# Altium schematic sheet 300_Control.SchDoc: Control
size A3; SheetNumber: 5; SheetTotal: 7
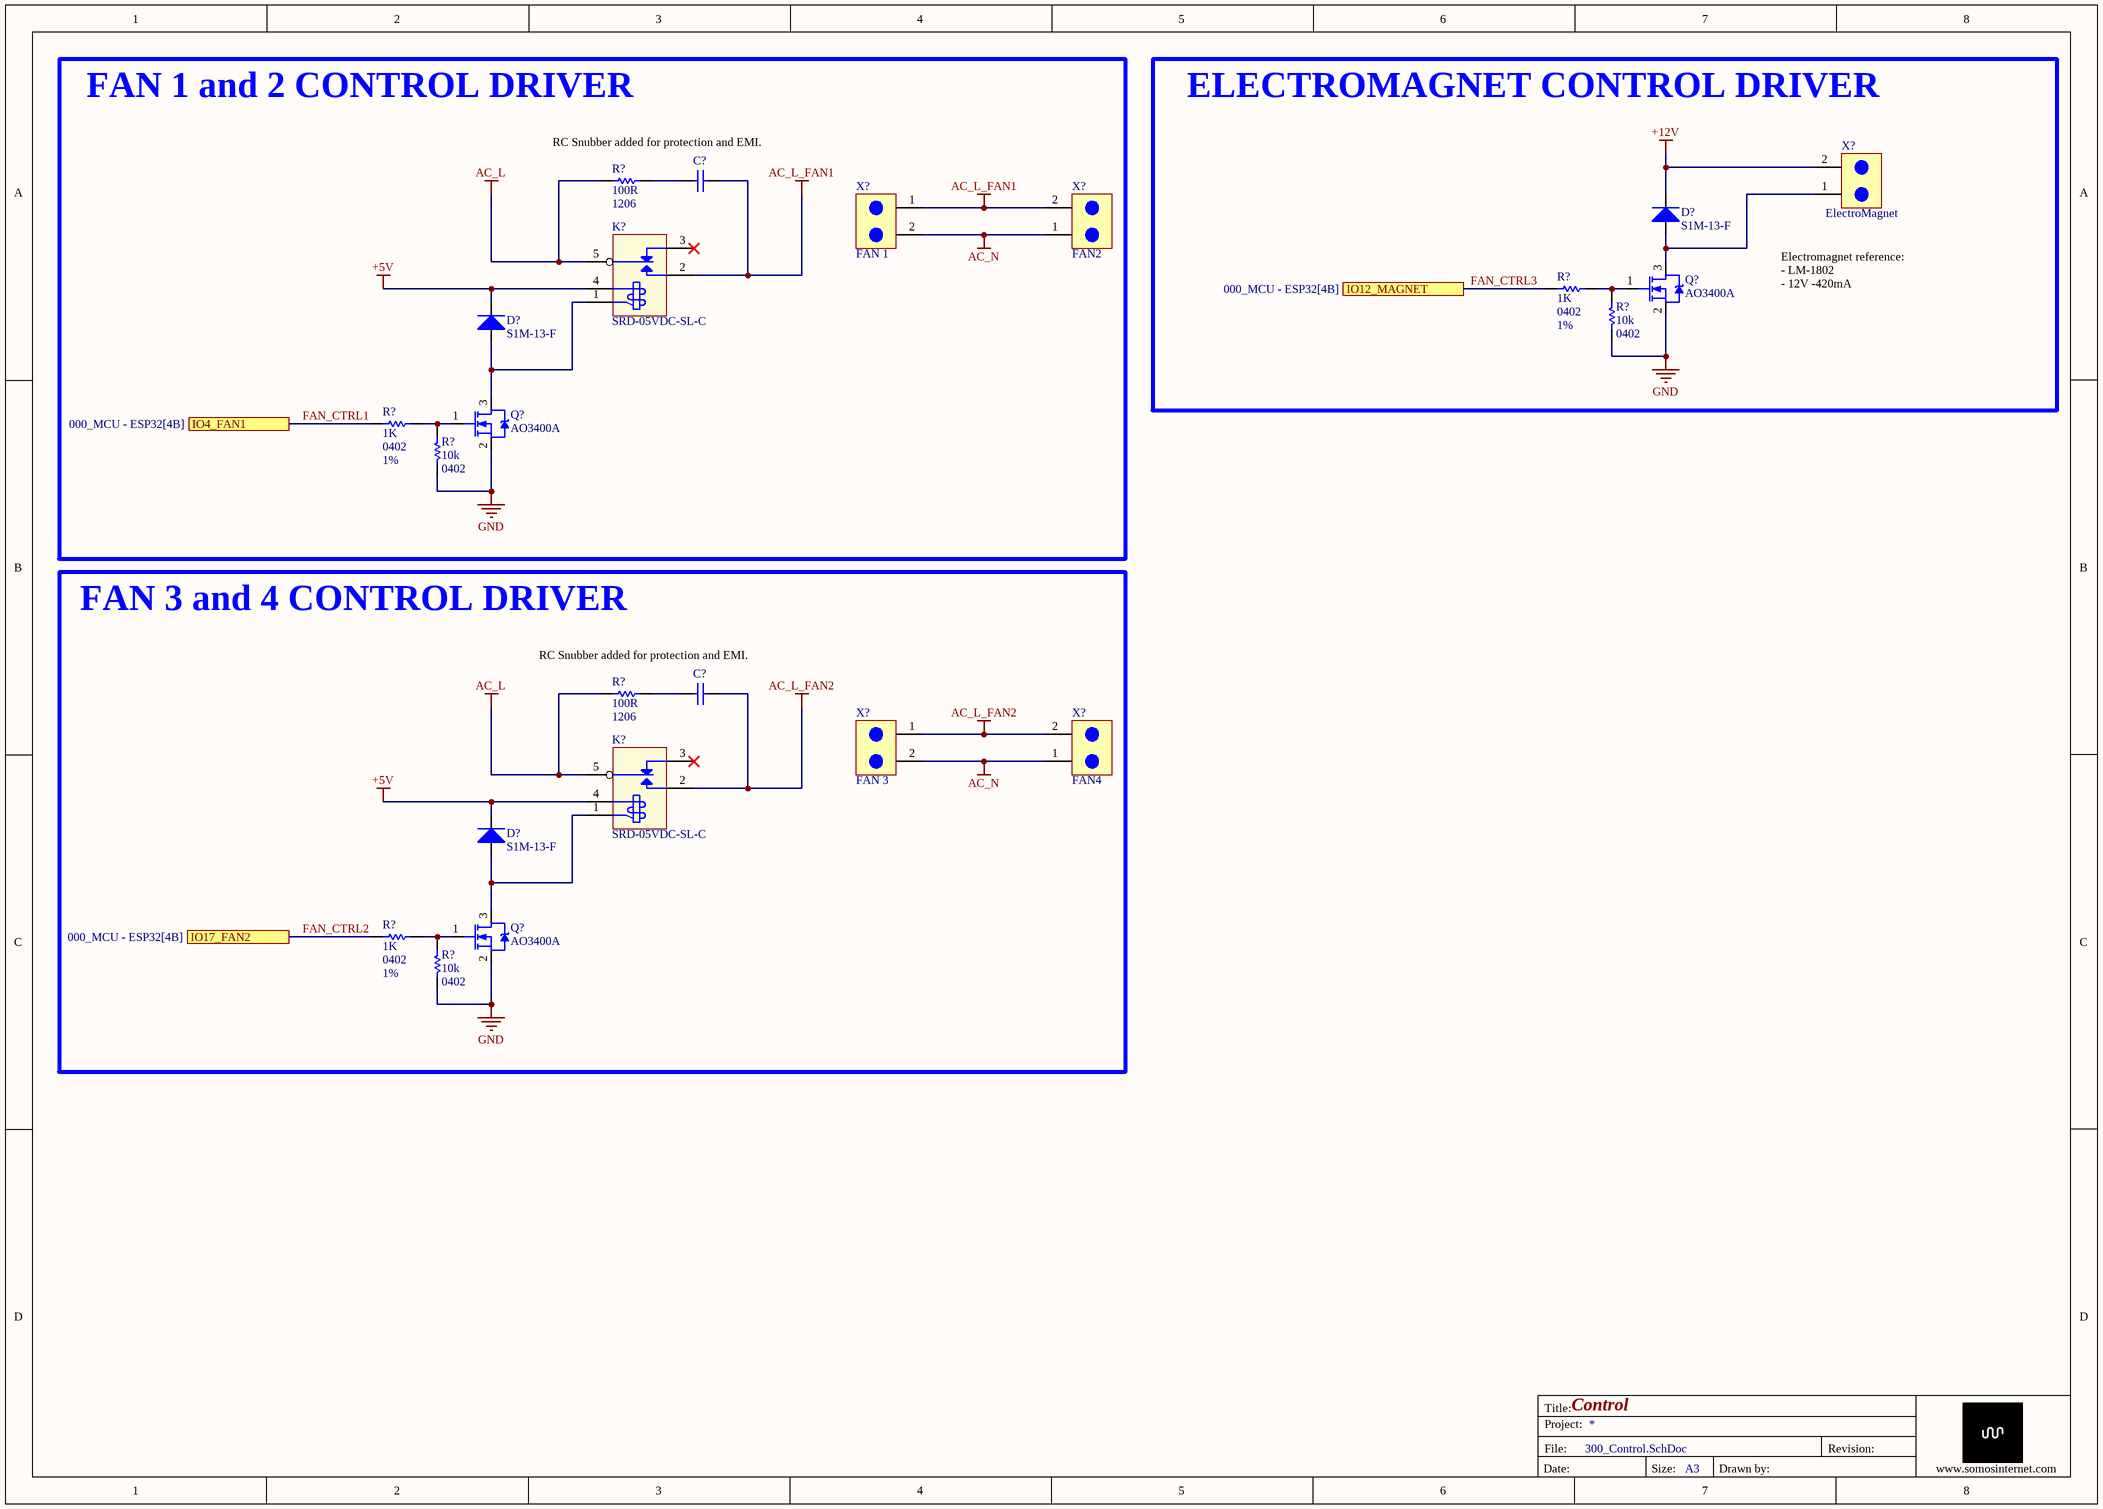
[diagram p0: 300_Control.SchDoc]

## Parts
(Parts that share a designator on the sheet are numbered #1, #2 ... from top to bottom, then left to right.)
C?#1  MPX104K31C3KN15600  [Safety Capacitor TH,P=10mm]  (value not drawn)
C?#2  MPX104K31C3KN15600  [Safety Capacitor TH,P=10mm]  (value not drawn)
D?#1  S1M-13-F  [DO214AC]
D?#2  S1M-13-F  [DO214AC]
D?#3  S1M-13-F  [DO214AC]
K?#1  SRD-05VDC-SL-C  [Relay_1C TH_19.2x15.6mm]
K?#2  SRD-05VDC-SL-C  [Relay_1C TH_19.2x15.6mm]
Q?#1  AO3400A  [SOT23_N]
Q?#2  AO3400A  [SOT23_N]
Q?#3  AO3400A  [SOT23_N]
R?#1  100R  PackageReference: 1206  [RESC3216X06N[1206]]
R?#2  1K  PackageReference: 0402  Tolerance: 1%  [RESC1005X03N[0402]]
R?#3  10k  PackageReference: 0402  [RESC1005X03N[0402]]
R?#4  1K  PackageReference: 0402  Tolerance: 1%  [RESC1005X03N[0402]]
R?#5  10k  PackageReference: 0402  [RESC1005X03N[0402]]
R?#6  100R  PackageReference: 1206  [RESC3216X06N[1206]]
R?#7  1K  PackageReference: 0402  Tolerance: 1%  [RESC1005X03N[0402]]
R?#8  10k  PackageReference: 0402  [RESC1005X03N[0402]]
X?#1  FAN 1  [TH,Right Angle,P=5mm]
X?#2  ElectroMagnet  [TH,Right Angle,P=5mm]
X?#3  FAN2  [TH,Right Angle,P=5mm]
X?#4  FAN 3  [TH,Right Angle,P=5mm]
X?#5  FAN4  [TH,Right Angle,P=5mm]

## Blocks framed on the sheet
FAN 1 and 2 CONTROL DRIVER: C?#1 D?#2 K?#1 Q?#2 R?#1 R?#4 R?#5 X?#1 X?#3
ELECTROMAGNET CONTROL DRIVER: D?#1 Q?#1 R?#2 R?#3 X?#2
FAN 3 and 4 CONTROL DRIVER: C?#2 D?#3 K?#2 Q?#3 R?#6-R?#8 X?#4 X?#5

## Ports
IO4_FAN1 (see 000_MCU - ESP32[4B]), IO12_MAGNET (see 000_MCU - ESP32[4B]), IO17_FAN2 (see 000_MCU - ESP32[4B])

## Nets
+5V: D?#2.K D?#3.K K?#1.4 K?#2.4
+12V: D?#1.K X?#2.2
AC_L: K?#1.5 K?#2.5 R?#1.1 R?#6.1
AC_L_FAN1: C?#1.2 K?#1.2 X?#1.1 X?#3.2
AC_L_FAN2: C?#2.2 K?#2.2 X?#4.1 X?#5.2
AC_N: X?#1.2 X?#3.1 X?#4.2 X?#5.1
GND: Q?#1.2(S) Q?#2.2(S) Q?#3.2(S) R?#3.2 R?#5.2 R?#8.2
FAN_CTRL1: R?#4.2 ; port IO4_FAN1
FAN_CTRL2: R?#7.2 ; port IO17_FAN2
FAN_CTRL3: R?#2.2 ; port IO12_MAGNET
NetC?#1_1: C?#1.1 R?#1.2
NetC?#2_1: C?#2.1 R?#6.2
NetD?#1_A: D?#1.A Q?#1.3(D) X?#2.1
NetD?#2_A: D?#2.A K?#1.1 Q?#2.3(D)
NetD?#3_A: D?#3.A K?#2.1 Q?#3.3(D)
NetQ?#1_1: Q?#1.1(G) R?#2.1 R?#3.1
NetQ?#2_1: Q?#2.1(G) R?#4.1 R?#5.1
NetQ?#3_1: Q?#3.1(G) R?#7.1 R?#8.1

Not connected (* = marked no-connect by the designer): K?#1 3*; K?#2 3*

## Notes on the sheet
- RC Snubber added for protection and EMI.
- Electromagnet reference:
  - LM-1802
  - 12V -420mA
- Title:
- Project:
- File:
- Revision:
- Date:
- Size:
- A3
- Drawn by:
- www.somosinternet.com <http://www.somosinternet.com>

## Library data of the parts
C?#1 C?#2 = Safety Capacitor MPX104K31C3KN15600: CAP SAFETY 100nF ±10% 275V 305V 310V TH; Manufacturer: KNSCHA; Manufacturer Part Number: MPX104K31C3KN15600; Supplier 1: LCSC; Supplier Part Number 1: C489079; ComponentLink1Description: LCSC; ComponentLink1URL: https://www.lcsc.com/product-detail/C489079.html
D?#1-D?#3 = Diode: DIODES S1M-13-F; Supplier Part Number 1: C155378; Supplier 1: LCSC; Manufacturer: DIODES; Manufacturer PArt Number: S1M-13-F
K?#1 K?#2 = SRD-05VDC-SL-C: Songle Relay SRD-05VDC-SL-C; Manufacturer: Songle Relay; Manufacturer Part Number: SRD-05VDC-SL-C; Supplier Part Number 1: C35449; Supplier 1: LCSC; ComponentLink1Description: LCSC; ComponentLink1URL: https://www.lcsc.com/product-detail/C35449.html
Q?#1-Q?#3 = NMOS-3: N-Channel Power MOSFET; Manufacturer: AOS; Manufacturer Part Number: AO3400A; Supplier 1: LCSC; Supplier Part Number 1: C20917; ComponentLink1Description: LCSC; ComponentLink1URL: https://www.lcsc.com/product-detail/C20917.html?s_z=n_q_AO3400A
R?#1 R?#6 = RES-generic: RES 100Ω ±1% 500mW 1206; Manuf1: FOJAN; Manuf2: FRP1206F1000TS; Populated: Yes; Value: 100R; Manuf1Partnumber: *; Manuf2Partnumber: *; ClassName: *; ROHS: Yes; LifeCycle: Checked; HelpURL: *; Power: *; Tolerance: *; Supplier 1: LCSC; Supplier Part Number 1: C5713416
R?#2 R?#4 R?#7 = RES-generic: Chip Resistor SMD; Populated: Yes; Value: 1K; Manuf1: *; Manuf2: *; Manuf1Partnumber: *; Manuf2Partnumber: *; ClassName: *; ROHS: Yes; LifeCycle: Checked; HelpURL: *; Power: *; Supplier 1: Digikey; Supplier Part Number 1: P1.00KLDKR-ND
R?#3 R?#5 R?#8 = RES-generic: Chip Resistor SMD; Populated: Yes; Tolerance: 1%; Value: 10k; Manuf1: *; Manuf2: *; Manuf1Partnumber: *; Manuf2Partnumber: *; ClassName: *; ROHS: Yes; LifeCycle: Checked; HelpURL: *; Power: *; Supplier 1: Digikey; Supplier Part Number 1: 1276-3431-1-ND
X?#1-X?#5 = TERMINAL BLOCK 2PIN 5mm: TERM BLOCK HDR 2POS 5MM; Manufacturer: Cixi Kefa Elec; Manufacturer Part number: KF2EDGRC-5.0-2P; Supplier: LCSC; Supplier Part Number 1: C441225; ComponentLink1Description: LCSC; ComponentLink1URL: https://www.lcsc.com/product-detail/C441225.html